# EAGLE design motor (EAGLE 5.11)
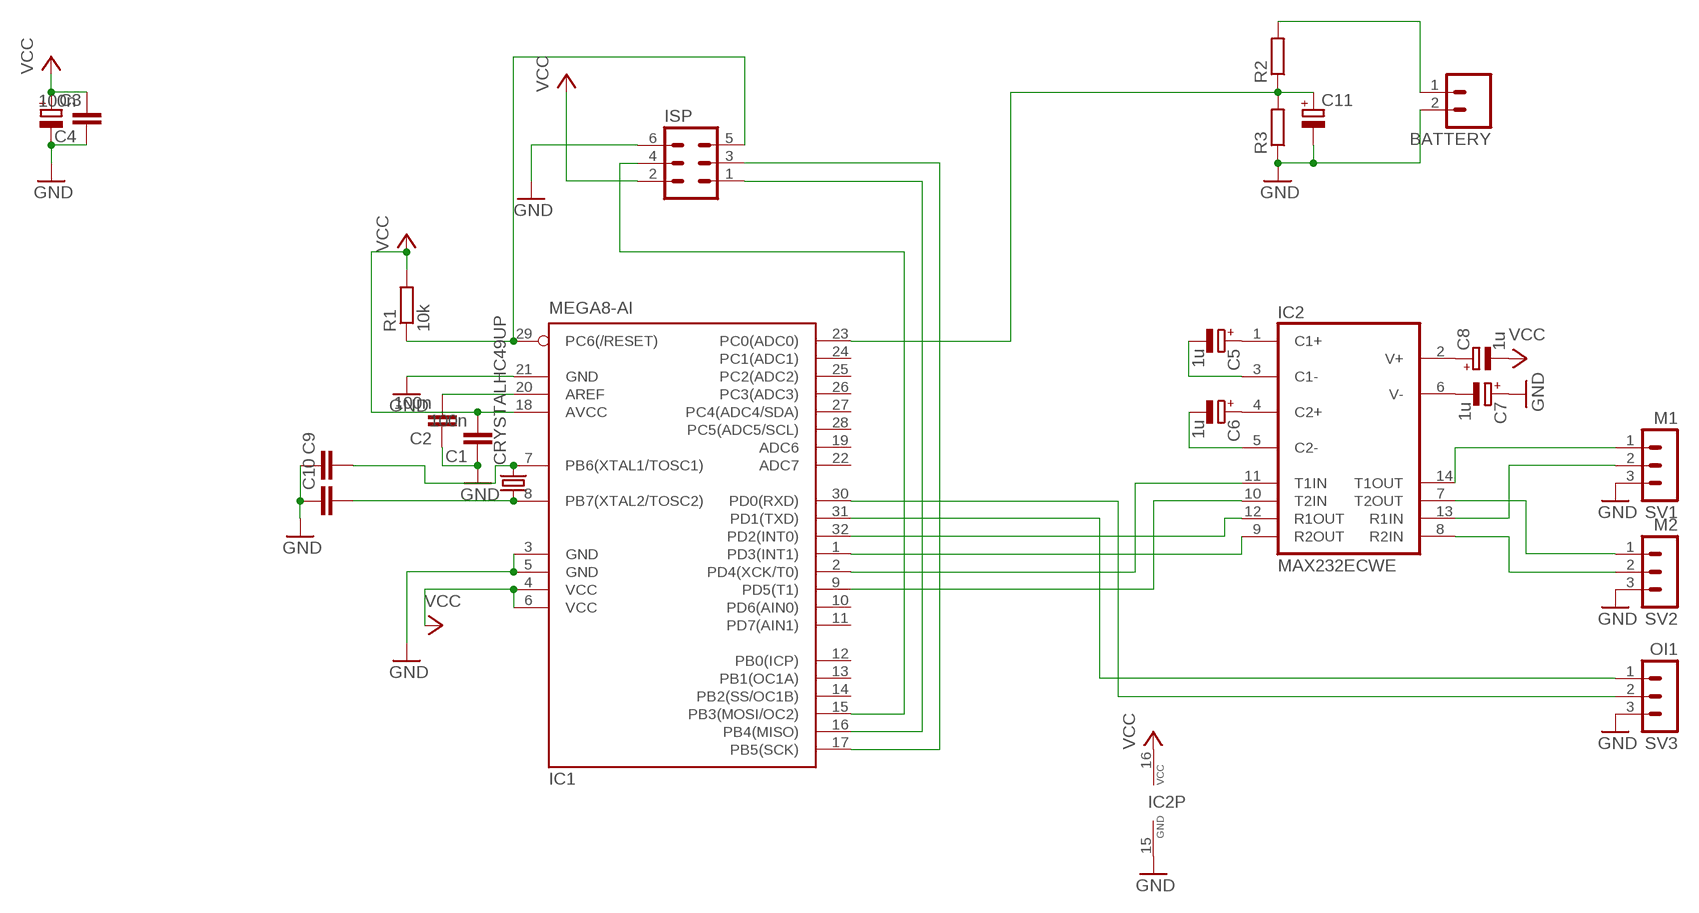
[diagram p0: schematic, sheet 1]

## Parts
BATTERY  MA02  [02PA]
C1  100n  C-EUC0805  [C0805]
C2  100n  C-EUC0805  [C0805]
C3  CPOL-EUSMCA  [SMC_A]
C4  100n  C-EUC0805  [C0805]
C5  1u  CPOL-EUSMCA  [SMC_A]
C6  1u  CPOL-EUSMCA  [SMC_A]
C7  1u  CPOL-EUSMCA  [SMC_A]
C8  1u  CPOL-EUSMCA  [SMC_A]
C9  C-EUC0805  [C0805]
C10  C-EUC0805  [C0805]
C11  CPOL-EUSMCA  [SMC_A]
CRYSTALHC49UP  CRYSTALHC49UP  [HC49UP]
IC1  MEGA8-AI  [TQFP32-08]
IC2  MAX232ECWE  [SO16L]
ISP  MA03-2  [MA03-2]
R1  10k  R-EU_R0805  [R0805]
R2  R-EU_0207/7  [0207/7]
R3  R-EU_0207/7  [0207/7]
SV1  M1  MA03-1  [MA03-1]
SV2  M2  MA03-1  [MA03-1]
SV3  OI1  MA03-1  [MA03-1]

## Nets
GND: BATTERY.2 C1.1 C2.1 C3.- C4.1 C7.+ C9.1 C10.1 C11.- IC1.3(GND) IC1.5(GND) IC1.21(GND) IC2.15(GND) ISP.6 R3.1 SV1.3 SV2.3 SV3.3
N$1: C9.2 CRYSTALHC49UP.2 IC1.7(PB6(XTAL1/TOSC1))
N$2: C2.2 IC1.20(AREF)
N$3: IC1.29(PC6(/RESET)) ISP.5 R1.1
N$4: IC2.14(T1OUT) SV1.1
N$5: IC1.15(PB3(MOSI/OC2)) ISP.4
N$6: IC1.17(PB5(SCK)) ISP.3
N$7: IC1.16(PB4(MISO)) ISP.1
N$8: IC2.13(R1IN) SV1.2
N$9: IC2.8(R2IN) SV2.2
N$10: C5.+ IC2.1(C1+)
N$11: C6.+ IC2.4(C2+)
N$12: C7.- IC2.6(V-)
N$13: C8.+ IC2.2(V+)
N$14: C6.- IC2.5(C2-)
N$15: C5.- IC2.3(C1-)
N$16: IC2.7(T2OUT) SV2.1
N$17: IC1.1(PD3(INT1)) IC2.9(R2OUT)
N$18: IC1.32(PD2(INT0)) IC2.12(R1OUT)
N$19: IC1.2(PD4(XCK/T0)) IC2.11(T1IN)
N$20: IC1.9(PD5(T1)) IC2.10(T2IN)
N$21: IC1.30(PD0(RXD)) SV3.2
N$22: IC1.31(PD1(TXD)) SV3.1
N$23: C11.+ IC1.23(PC0(ADC0)) R2.1 R3.2
N$24: C10.2 CRYSTALHC49UP.1 IC1.8(PB7(XTAL2/TOSC2))
N$25: BATTERY.1 R2.2
VCC: C1.2 C3.+ C4.2 C8.- IC1.4(VCC) IC1.6(VCC) IC1.18(AVCC) IC2.16(VCC) ISP.2 R1.2
Unconnected: IC1.10(PD6(AIN0)) IC1.11(PD7(AIN1)) IC1.12(PB0(ICP)) IC1.13(PB1(OC1A)) IC1.14(PB2(SS/OC1B)) IC1.19(ADC6) IC1.22(ADC7) IC1.24(PC1(ADC1)) IC1.25(PC2(ADC2)) IC1.26(PC3(ADC3)) IC1.27(PC4(ADC4/SDA)) IC1.28(PC5(ADC5/SCL))

## Library data of the parts
BATTERY = con-amp-quick:MA02: AMP QUICK CONNECTOR; OC_FARNELL: unknown; OC_NEWARK: unknown
C1 C2 C4 = resistor:C-EU: CAPACITOR, European symbol
C3 C5-C8 C11 = rcl:CPOL-EU: POLARIZED CAPACITOR, European symbol
C9 C10 = rcl:C-EU: CAPACITOR, European symbol
CRYSTALHC49UP = crystal:CRYSTAL: CRYSTAL; OC_FARNELL: unknown; OC_NEWARK: unknown
IC1 = atmel:MEGA8: MICROCONTROLLER 8 Kbytes FLASH, 1 kbytes SRAM, 512 bytes EEPROM, USART, 6-channel 10 bit ADC, 2-channel 8 bit ADC Pin compatible with Atmega48, ATMega88, ATMega168 Source: avr.lbr; MPN: ATMEGA8-16AU; OC_FARNELL: 9171371; OC_NEWARK: 73M8863
IC2 = maxim:MAX232ECWE: RS232 TRANSEIVER; MF: MAXIM; MPN: MAX232ECWE+; OC_FARNELL: 9724435; OC_NEWARK: 67K4440
ISP = con-lstb:MA03-2: PIN HEADER; OC_FARNELL: unknown; OC_NEWARK: unknown
R1-R3 = rcl:R-EU_: RESISTOR, European symbol
SV1-SV3 = con-lstb:MA03-1: PIN HEADER; OC_FARNELL: unknown; OC_NEWARK: unknown

## Board
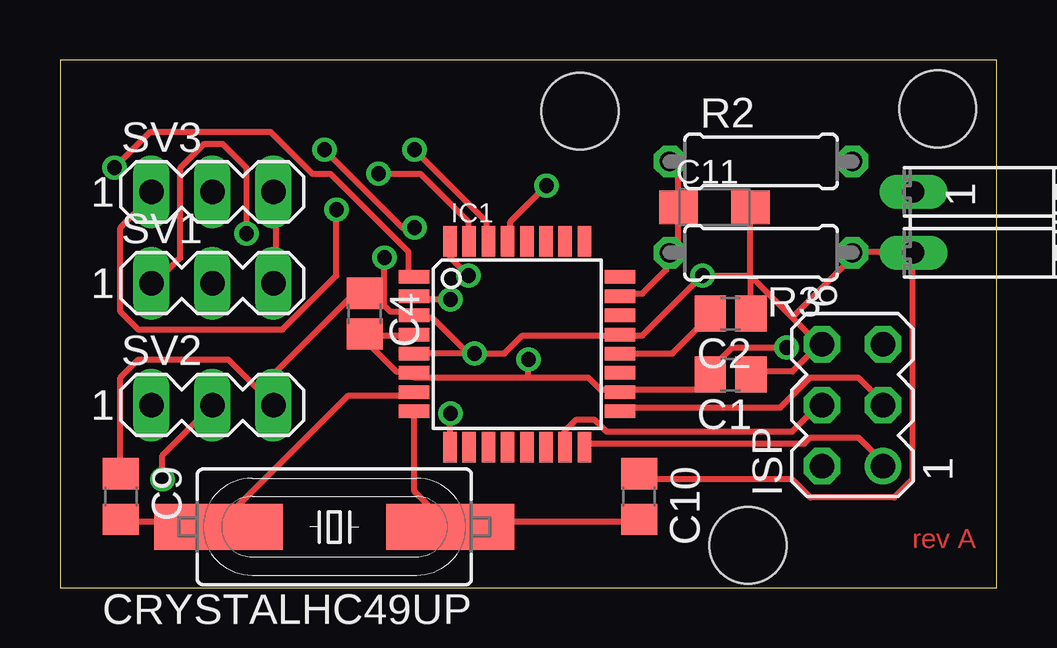
[diagram p1: board, top side]
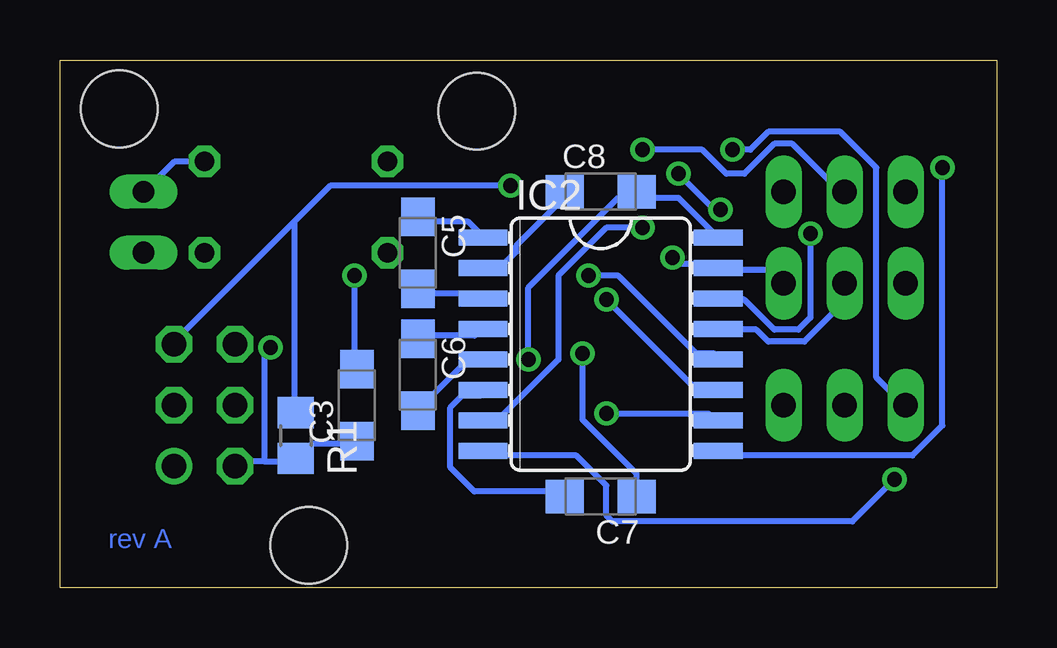
[diagram p2: board, bottom side, seen from below]

Size 39.04 x 22.01 mm. Coordinates in mm from the lower left corner, seen from the top.
Outline: 0,0 39.04,0 39.04,22.01 0,22.01 0,0
Copper layers (1*16): Top 0.035mm / dielectric 1.5mm / Bottom 0.035mm
Design rules "default": minimum track width 10mil, minimum drill 24mil, track to track 8mil, track to pad 8mil, pad to pad 8mil, via to via 8mil, smd to smd 8mil, copper to edge 40mil, drill to drill 8mil, minimum pad ring 10mil, minimum via ring 8mil, stop-mask expansion 4mil, vias tented up to drill 0mil, thermal gap 10mil
Holes 3.2 mm at 28.67,1.77 21.67,19.87 36.57,19.97

### Footprints (pad centres in the part's own frame; a part is rotated, then mirrored left to right if it is on the bottom)
02PA = drill 0.914 long: 1 -1.27,0; 2 1.27,0
C0805 = smd 1.3 x 1.5: 1 -0.85,0; 2 0.85,0
SMC_A = smd 1.6 x 1.4: + -1.5,0; - 1.5,0
C0805' = smd 1.3 x 1.5: 1 -0.95,0; 2 0.95,0
HC49UP = smd 5.334 x 1.93: 1 -4.826,0; 2 4.826,0
TQFP32-08 = smd 1.27 x 0.559: 1 -4.293,2.8; 2 -4.293,2; 3 -4.293,1.2; 4 -4.293,0.4; 5 -4.293,-0.4; 6 -4.293,-1.2; 7 -4.293,-2; 8 -4.293,-2.8; 17 4.293,-2.8; 18 4.293,-2; 19 4.293,-1.2; 20 4.293,-0.4; 21 4.293,0.4; 22 4.293,1.2; 23 4.293,2; 24 4.293,2.8 | smd 0.559 x 1.27: 9 -2.8,-4.293; 10 -2,-4.293; 11 -1.2,-4.293; 12 -0.4,-4.293; 13 0.4,-4.293; 14 1.2,-4.293; 15 2,-4.293; 16 2.8,-4.293; 25 2.8,4.293; 26 2,4.293; 27 1.2,4.293; 28 0.4,4.293; 29 -0.4,4.293; 30 -1.2,4.293; 31 -2,4.293; 32 -2.8,4.293
SO16L = smd 0.66 x 2.032: 1 -4.445,-4.902; 2 -3.175,-4.902; 3 -1.905,-4.902; 4 -0.635,-4.902; 5 0.635,-4.902; 6 1.905,-4.902; 7 3.175,-4.902; 8 4.445,-4.902; 9 4.445,4.902; 10 3.175,4.902; 11 1.905,4.902; 12 0.635,4.902; 13 -0.635,4.902; 14 -1.905,4.902; 15 -3.175,4.902; 16 -4.445,4.902
MA03-2 = drill 1.016 round: 1 -2.54,-1.27 | drill 1.016 octagon: 2 -2.54,1.27; 3 0,-1.27; 4 0,1.27; 5 2.54,-1.27; 6 2.54,1.27
R0805 = smd 1.3 x 1.5: 1 -0.95,0; 2 0.95,0
0207/7 = drill 0.813 octagon: 1 -3.81,0; 2 3.81,0
MA03-1 = drill 1.016 long: 1 -2.54,0; 2 0,0; 3 2.54,0

### Placement (x,y rotation side)
BATTERY  35.56,15.24 270 top
C1  27.94,8.89 180 top
C2  27.94,11.43 180 top
C3  26.67,7.62 90 bottom
C4  12.7,11.43 270 top
C5  24.13,13.97 270 bottom
C6  24.13,8.89 270 bottom
C7  16.51,3.81 180 bottom
C8  16.51,16.51 0 bottom
C9  [C0805']  2.54,3.81 270 top
C10  [C0805']  24.13,3.81 270 top
C11  27.27,15.87 0 top
CRYSTALHC49UP  11.43,2.54 180 top
IC1  19.05,10.16 0 top
IC2  16.51,10.16 270 bottom
ISP  33.02,7.62 90 top
R1  29.21,6.35 270 bottom
R2  29.21,17.78 0 top
R3  29.21,13.97 180 top
SV1  6.35,12.7 0 top
SV2  6.35,7.62 0 top
SV3  6.35,16.51 0 top

### Tracks (layer width: path | path; a pad name or v marks a point on that pad's centre or on a via)
GND  (via drill 0.61)
  Top 0.254: C1.1 29.02,9.02 30.52,9.02 31.52,10.02 ISP.6 31.52,10.27 30.52,11.27 | 28.77,13.02 28.77,11.52 C2.1 | 28.77,13.02 C11.- | 28.77,13.02 v26.77,13.02 24.27,10.52 23.52,10.52 IC1.21 23.27,10.52 19.27,10.52 18.52,9.77 v17.27,9.77 17.02,9.77 | 28.77,13.02 30.52,11.27 | C10.1 24.27,4.52 30.52,4.52 31.27,3.77 34.77,3.77 35.52,4.52 35.52,13.77 BATTERY.2 35.52,14.02 33.02,14.02 R3.1 33.02,13.77 30.52,11.27 | 8.27,8.27 8.77,7.77 SV2.3 8.27,8.27 | 8.27,8.27 7.02,9.52 3.27,9.52 2.52,8.77 2.52,4.77 C9.1 | SV3.3 9.02,16.27 9.02,12.77 SV1.3 | 13.52,11.77 12.77,12.52 C4.1 12.52,12.52 8.27,8.27 | 13.52,11.77 13.77,11.52 14.52,11.52 IC1.3 14.77,11.27 15.52,11.27 17.02,9.77 | 17.02,9.77 IC1.5 | 13.52,11.77 v13.52,13.77
  Bottom 0.254: v26.77,13.02 26.77,9.27 C3.- | SV1.3 9.02,12.77 9.52,13.27 11.52,13.27 IC2.15 11.77,13.52 13.27,13.52 v13.52,13.77 | v17.27,9.77 17.27,7.02 15.02,4.77 15.02,4.02 C7.+
N$1
  Top 0.254: IC1.7 14.52,8.02 12.02,8.02 6.77,2.77 CRYSTALHC49UP.2 6.52,2.77 2.77,2.77 C9.2
N$2
  Top 0.254: IC1.20 23.52,9.77 25.52,9.77 27.02,11.27 C2.2
N$3  (via drill 0.61)
  Top 0.254: v20.27,16.77 18.77,15.27 18.77,14.52 IC1.29
  Bottom 0.254: v20.27,16.77 27.77,16.77 29.27,15.27 | 29.27,15.27 34.27,10.27 ISP.5 | 29.27,15.27 29.27,7.52 R1.1
N$4  (via drill 0.61)
  Top 0.254: v7.77,14.77 7.77,17.52 6.77,18.52 6.02,18.52 5.02,17.52 5.02,13.77 4.02,12.77 SV1.1
  Bottom 0.254: v7.77,14.77 7.77,11.27 8.27,10.77 9.27,10.77 10.52,12.02 11.52,12.02 IC2.14
N$5
  Top 0.254: IC1.15 21.02,6.02 21.02,6.52 21.52,7.02 22.27,7.02 22.77,6.52 30.52,6.52 31.52,7.52 ISP.4
N$6
  Top 0.254: IC1.17 23.52,7.52 30.02,7.52 31.27,8.77 33.27,8.77 34.27,7.77 ISP.3
N$7
  Top 0.254: IC1.16 22.02,6.02 31.02,6.02 31.27,6.27 33.27,6.27 34.27,5.27 ISP.1
N$8
  Bottom 0.254: IC2.13 11.52,10.77 10.02,10.77 9.52,10.27 8.02,10.27 6.52,11.77 6.52,12.52 SV1.2
N$9  (via drill 0.61)
  Top 0.254: v4.27,4.52 4.27,5.52 6.27,7.52 SV2.2
  Bottom 0.254: v4.27,4.52 6.02,2.77 16.02,2.77 16.27,3.02 16.27,4.27 17.52,5.52 21.27,5.52 IC2.8
N$10
  Bottom 0.254: C5.+ 24.02,15.27 22.02,15.27 21.52,14.77 IC2.1
N$11
  Bottom 0.254: C6.+ 24.02,10.52 21.77,10.52 21.52,10.77 IC2.4
N$12
  Bottom 0.254: C7.- 18.02,4.02 21.77,4.02 22.77,5.02 22.77,7.52 22.27,8.02 21.52,8.02 IC2.6
N$13
  Bottom 0.254: C8.+ 18.02,16.27 20.02,14.27 20.02,14.02 20.52,13.52 21.27,13.52 IC2.2
N$14
  Bottom 0.254: C6.- 24.02,7.52 22.02,9.52 21.52,9.52 IC2.5
N$15
  Bottom 0.254: C5.- 24.02,12.27 21.52,12.27 IC2.3
N$16  (via drill 0.61)
  Top 0.254: v14.77,15.02 14.27,15.02 v11.02,18.27
  Bottom 0.254: v14.77,15.02 16.27,15.02 18.27,13.02 18.27,9.52 20.77,7.02 21.27,7.02 IC2.7 | v11.02,18.27 10.27,18.27 9.52,19.02 6.52,19.02 5.02,17.52 5.02,8.77 4.02,7.77 SV2.1
N$17  (via drill 0.61)
  Top 0.254: v2.27,17.52 3.77,19.02 8.77,19.02 10.52,17.27 11.27,17.27 14.52,14.02 14.52,13.02 IC1.1
  Bottom 0.254: v2.27,17.52 2.27,6.77 3.52,5.52 11.52,5.52 IC2.9
N$18  (via drill 0.61)
  Top 0.254: v17.02,13.02 16.27,13.77 16.27,14.27 IC1.32
  Bottom 0.254: v17.02,13.02 15.77,13.02 12.52,9.77 11.77,9.77 IC2.12
N$19  (via drill 0.61)
  Top 0.254: v16.27,12.02 14.77,12.02 IC1.2
  Bottom 0.254: v16.27,12.02 12.52,8.27 11.77,8.27 IC2.11
N$20  (via drill 0.61)
  Top 0.254: v16.27,7.27 16.27,6.02 IC1.9
  Bottom 0.254: v16.27,7.27 12.02,7.27 11.77,7.02 IC2.10
N$21  (via drill 0.61)
  Top 0.254: v14.77,18.27 17.77,15.27 17.77,14.52 IC1.30
  Bottom 0.254: v14.77,18.27 12.27,18.27 11.27,17.27 10.52,17.27 9.27,18.52 8.52,18.52 6.52,16.52 SV3.2
N$22  (via drill 0.61)
  Top 0.254: v13.27,17.27 15.02,17.27 17.02,15.27 17.02,14.52 IC1.31 | v11.52,15.77 11.52,13.02 9.27,10.77 3.27,10.77 2.52,11.52 2.52,15.02 3.77,16.27 SV3.1
  Bottom 0.254: v13.27,17.27 11.77,15.77 v11.52,15.77
N$23
  Top 0.254: R2.1 25.52,17.77 25.77,17.52 C11.+ 25.77,14.27 25.52,14.02 R3.2 25.27,13.77 25.27,13.27 24.27,12.27 23.52,12.27 IC1.23
N$24
  Top 0.254: IC1.8 14.77,7.27 14.77,4.02 16.02,2.77 CRYSTALHC49UP.1 16.27,2.77 24.02,2.77 C10.2
N$25
  Bottom 0.254: R2.2 34.27,17.77 35.52,16.52 BATTERY.1
VCC  (via drill 0.61)
  Top 0.254: IC1.4 14.52,10.52 12.77,10.52 C4.2 12.52,10.52 14.02,9.02 14.52,9.02 IC1.6 14.77,8.77 19.52,8.77 | 19.52,8.77 22.02,8.77 22.52,8.27 23.27,8.27 IC1.18 23.52,8.27 26.52,8.27 27.02,8.77 C1.2 27.02,9.02 28.02,10.02 v30.27,10.02 | 19.52,8.77 v19.52,9.52
  Bottom 0.254: 30.52,5.27 31.52,5.27 ISP.2 | 30.52,5.27 29.27,5.27 R1.2 29.02,5.52 28.52,6.02 26.77,6.02 C3.+ | IC2.16 11.77,14.77 13.27,16.27 14.77,16.27 C8.- 15.02,16.27 15.77,16.27 19.52,12.52 v19.52,9.52 | 30.52,5.27 30.52,9.77 v30.27,10.02

### Text on the board
Top: rev A
Bottom: rev A